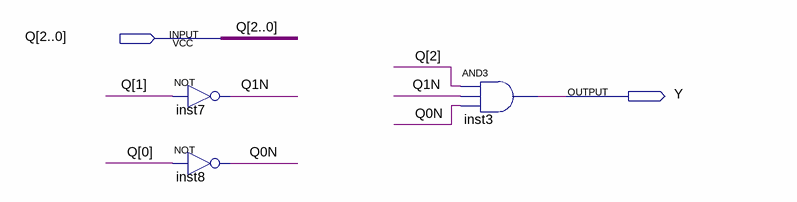
[diagram p0: schematic sheet]
// Quartus schematic OUTPUT.bdf as structural Verilog: 3 symbols, 2 pins
module OUTPUT (
  input  [2:0] Q,
  output Y
);

  wire Q0N, Q1N;

  not inst7 (Q1N, Q[1]);
  not inst8 (Q0N, Q[0]);
  and inst3 (Y, Q[2], Q1N, Q0N);
endmodule
